# Altium schematic sheet TCAN1146_PWR_MGMT.SchDoc
size C; SheetNumber: 2; SheetTotal: 17
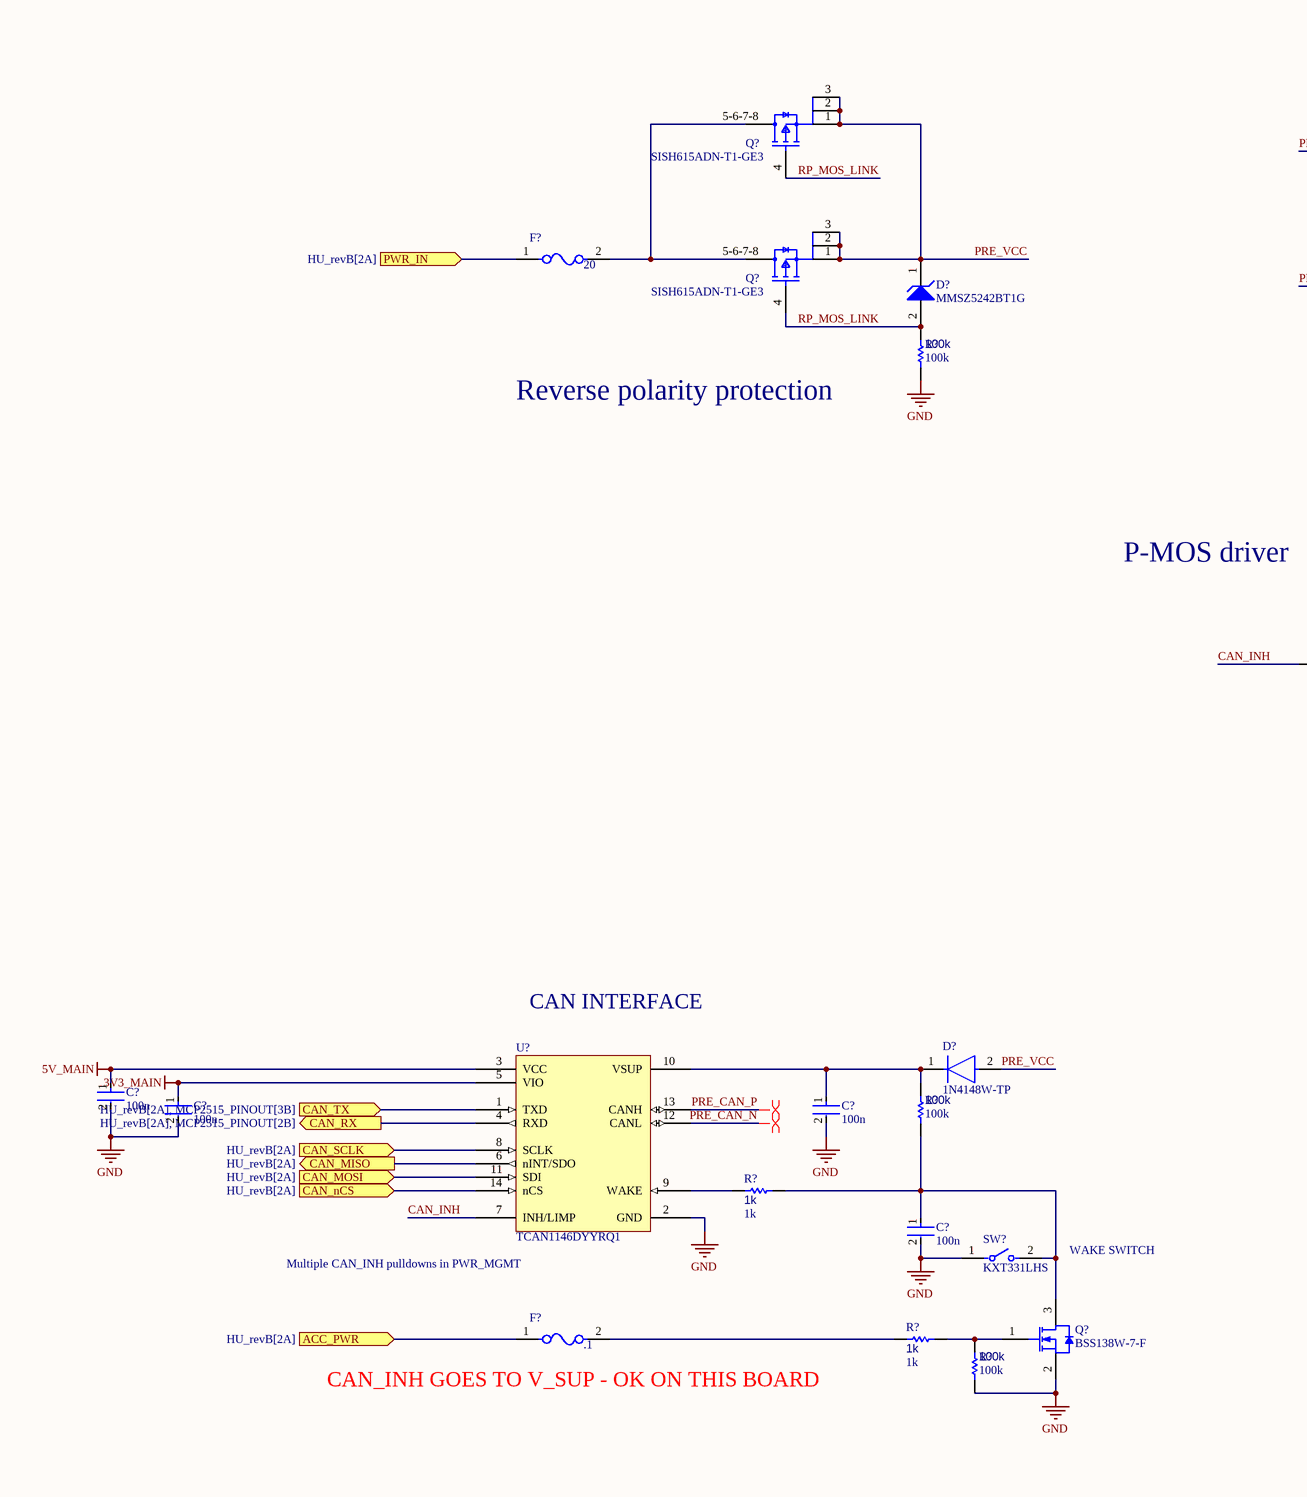
[diagram p0: TCAN1146_PWR_MGMT.SchDoc, left]
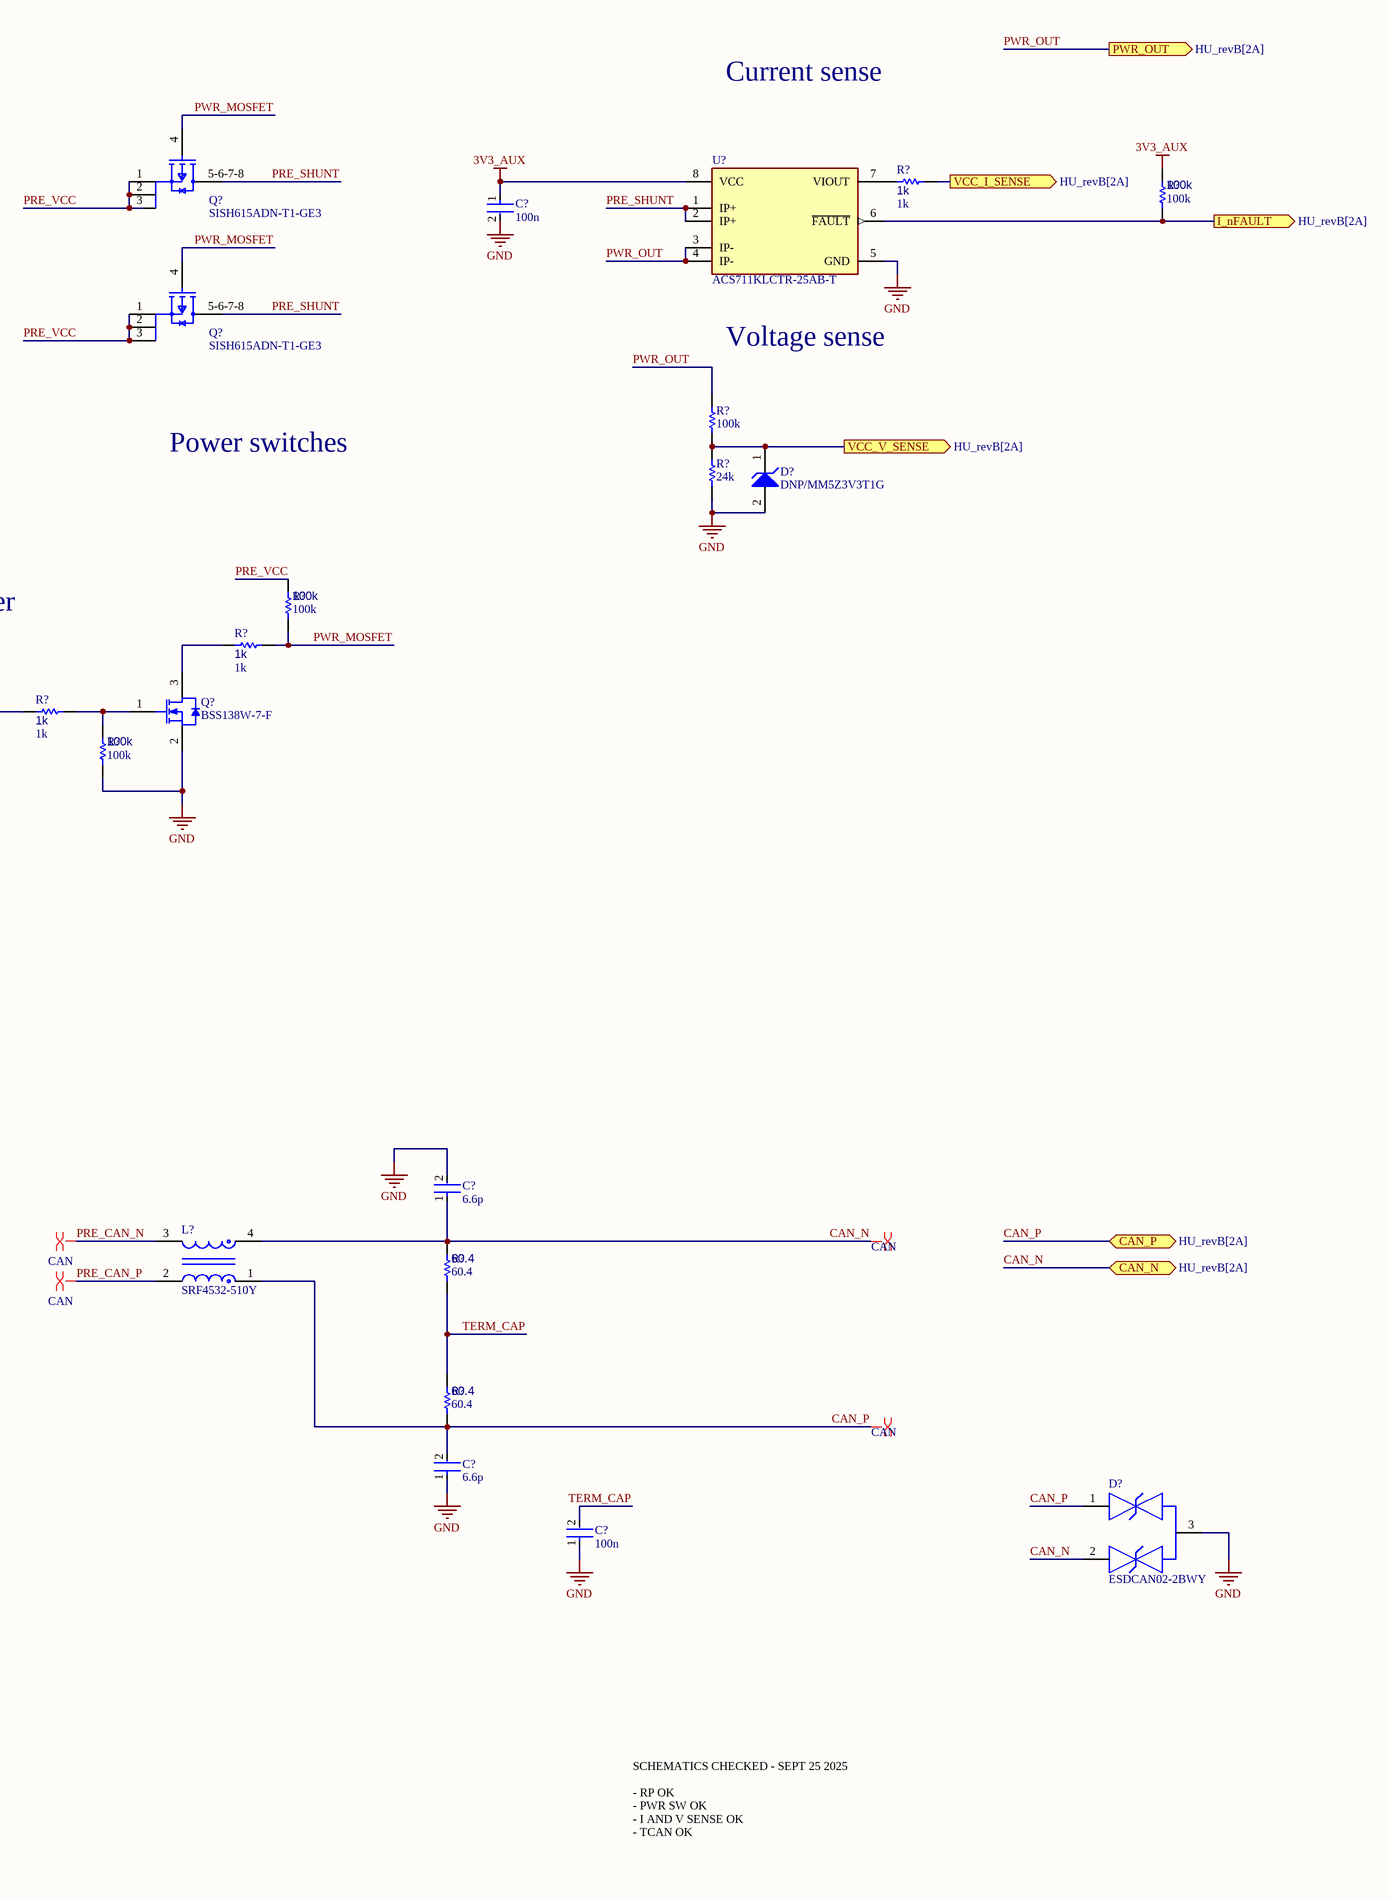
[diagram p1: TCAN1146_PWR_MGMT.SchDoc, right]

## Parts
(Parts that share a designator on the sheet are numbered #1, #2 ... from top to bottom, then left to right.)
C?#1  100n  [FP-0402-L_1_0_0_05-W_0_5-IPC_A]
C?#2  100n  [FP-0402-L_1_0_0_05-W_0_5-IPC_A]
C?#3  100n  [FP-0402-L_1_0_0_05-W_0_5-IPC_A]
C?#4  100n  [FP-0402-L_1_0_0_05-W_0_5-IPC_A]
C?#5  6.6p  [FP-0402-L_1_0_0_05-W_0_5-IPC_A]
C?#6  100n  [FP-0402-L_1_0_0_05-W_0_5-IPC_A]
C?#7  6.6p  [FP-0402-L_1_0_0_05-W_0_5-IPC_A]
C?#8  100n  [FP-0402-L_1_0_0_05-W_0_5-IPC_A]
D?#1  MMSZ5242BT1G  [ONSC-SOD-123-2-425-04_V]
D?#2  DNP/MM5Z3V3T1G  [ONSC-SOD-523-2-502-01_V]
D?#3  1N4148W-TP  [FP-SOD-123-IPC_A]
D?#4  ESDCAN02-2BWY  [FP-SOT323-3L-MFG]
F?#1  20  [FP-0685T-MFG]
F?#2  .1  [FP-0685T-MFG]
L?  SRF4532-510Y  [FP-SRF4532-MFG]
Q?#1  SISH615ADN-T1-GE3  [SISH615ADN-T1-GE3-Footprint-1]
Q?#2  SISH615ADN-T1-GE3  [SISH615ADN-T1-GE3-Footprint-1]
Q?#3  SISH615ADN-T1-GE3  [SISH615ADN-T1-GE3-Footprint-1]
Q?#4  SISH615ADN-T1-GE3  [SISH615ADN-T1-GE3-Footprint-1]
Q?#5  BSS138W-7-F  [DIOD-SOT323-3_V]
Q?#6  BSS138W-7-F  [DIOD-SOT323-3_V]
R?#1  1k  [R0603B]
R?#2  100k  [R0603B]
R?#3  100k  [R0603B]
R?#4  100k  [R0603B]
R?#5  24k  [R0603B]
R?#6  100k  [R0603B]
R?#7  1k  [R0603B]
R?#8  1k  [R0603B]
R?#9  100k  [R0603B]
R?#10  100k  [R0603B]
R?#11  1k  [R0603B]
R?#12  60.4  [R0603B]
R?#13  1k  [R0603B]
R?#14  100k  [R0603B]
R?#15  60.4  [R0603B]
SW?  KXT331LHS  [FP-KXT331LHS-MFG]
U?#1  ACS711KLCTR-25AB-T  [FP-LC-8-IPC_A]
U?#2  TCAN1146DYYRQ1  [TCAN1146DYYRQ1-Footprint-1]

## Ports
ACC_PWR (in, see HU_revB[2A]), CAN_MISO (out, see HU_revB[2A]), CAN_MOSI (in, see HU_revB[2A]), CAN_N (bidir, see HU_revB[2A]), CAN_nCS (in, see HU_revB[2A]), CAN_P (bidir, see HU_revB[2A]), CAN_RX (out, see HU_revB[2A], MCP2515_PINOUT[2B]), CAN_SCLK (in, see HU_revB[2A]), CAN_TX (in, see HU_revB[2A], MCP2515_PINOUT[3B]), I_nFAULT (out, see HU_revB[2A]), PWR_IN (in, see HU_revB[2A]), PWR_OUT (out, see HU_revB[2A]), VCC_I_SENSE (out, see HU_revB[2A]), VCC_V_SENSE (out, see HU_revB[2A])

## Nets
3V3_AUX: C?#1.1 R?#2.2 U?#1.8(VCC)
3V3_MAIN: C?#3.1 U?#2.5(VIO)
5V_MAIN: C?#2.1 U?#2.3(VCC)
GND: C?#1.2 C?#2.2 C?#3.2 C?#4.2 C?#5.2 C?#6.2 C?#7.1 C?#8.1 D?#2.2(A) D?#4.3 Q?#5.2(S) Q?#6.2(S) R?#3.1 R?#5.1 R?#9.1 R?#14.1 SW?.1 U?#1.5(GND) U?#2.2(GND)
ACC_PWR: F?#2.1 ; port ACC_PWR
CAN_INH: R?#8.1 U?#2.7(INH/LIMP)
CAN_MISO: U?#2.6(nINT/SDO) ; port CAN_MISO
CAN_MOSI: U?#2.11(SDI) ; port CAN_MOSI
CAN_N: C?#5.1 D?#4.2 L?.4 R?#12.2 ; port CAN_N
CAN_nCS: U?#2.14(nCS) ; port CAN_nCS
CAN_P: C?#7.2 D?#4.1 L?.1 R?#15.1 ; port CAN_P
CAN_RX: U?#2.4(RXD) ; port CAN_RX
CAN_SCLK: U?#2.8(SCLK) ; port CAN_SCLK
CAN_TX: U?#2.1(TXD) ; port CAN_TX
I_nFAULT: R?#2.1 U?#1.6(~{FAULT}) ; port I_nFAULT
PRE_CAN_N: L?.3 U?#2.12(CANL)
PRE_CAN_P: L?.2 U?#2.13(CANH)
PRE_SHUNT: Q?#1.5-6-7-8(D) Q?#3.5-6-7-8(D) U?#1.1(IP+) U?#1.2(IP+)
PRE_VCC: D?#1.1(K) D?#3.2(A) Q?#1.1(S) Q?#1.2(S) Q?#1.3(S) Q?#2.1(S) Q?#2.2(S) Q?#2.3(S) Q?#3.1(S) Q?#3.2(S) Q?#3.3(S) Q?#4.1(S) Q?#4.2(S) Q?#4.3(S) R?#6.2
PWR_IN: F?#1.1 ; port PWR_IN
PWR_MOSFET: Q?#1.4(G) Q?#3.4(G) R?#6.1 R?#7.2
PWR_OUT: R?#4.2 U?#1.3(IP-) U?#1.4(IP-) ; port PWR_OUT
RP_MOS_LINK: D?#1.2(A) Q?#2.4(G) Q?#4.4(G) R?#3.2
TERM_CAP: C?#8.2 R?#12.1 R?#15.2
VCC_I_SENSE: R?#1.1 ; port VCC_I_SENSE
VCC_V_SENSE: D?#2.1(K) R?#4.1 R?#5.2 ; port VCC_V_SENSE
NetC?#4_1: C?#4.1 D?#3.1(C) R?#10.2 U?#2.10(VSUP)
NetC?#6_1: C?#6.1 Q?#6.3(D) R?#10.1 R?#11.2 SW?.2
NetF?#1_2: F?#1.2 Q?#2.5-6-7-8(D) Q?#4.5-6-7-8(D)
NetF?#2_2: F?#2.2 R?#13.1
NetQ?#5_1: Q?#5.1(G) R?#8.2 R?#9.2
NetQ?#5_3: Q?#5.3(D) R?#7.1
NetQ?#6_1: Q?#6.1(G) R?#13.2 R?#14.2
NetR?#1_2: R?#1.2 U?#1.7(VIOUT)
NetR?#11_1: R?#11.1 U?#2.9(WAKE)

## Layout directives
differential pair: PRE_CAN_N, PRE_CAN_P
differential pair; differential pair class CAN: CAN_N, CAN_P, PRE_CAN_N, PRE_CAN_P

## Notes on the sheet
- Current sense
- Voltage sense
- (near R?#3) Reverse polarity protection
- Power switches
- P-MOS driver
- CAN INTERFACE
- (near U?#2) Multiple CAN_INH pulldowns in PWR_MGMT
- WAKE SWITCH
- (near F?#2) CAN_INH GOES TO V_SUP - OK ON THIS BOARD
- SCHEMATICS CHECKED - SEPT 25 2025
  - RP OK
  - PWR SW OK
  - I AND V SENSE OK
  - TCAN OK

## Library data of the parts
C?#1-C?#8 = CMP-001-00058-1: LARGE PADS, 0402 CAP, CHANGE COMMENT TO MATCH REAL P/N; Capacitor Type: Ceramic; Min Operating Temperature: -55°C; Mounting Technology: Surface Mount; Pins: 2; Case/Package: 0402; RoHS Compliant: Yes; Max Operating Temperature: 85°C
D?#1 = CMP-1060-00565-1: Zener Voltage Regulator, 500 mW, 2-Pin SOD-123, Pb-Free, Tape and Reel; Manufacturer: On Semiconductor; P Max (W): 0.5; VZ Typ (V): 12; PartNumber: MMSZ5242BT1G; PackageReference: SOD-123-2-425-04; ComponentLink3URL: http://www.onsemi.com/pub_link/Collateral/425-04.PDF; Mounting Technology: Surface Mount; ComponentLink2Description: Datasheet; ComponentLink1URL: http://www.onsemi.com/; ComponentLink3Description: Package Specification; PackageDescription: 2-Pin SOD, Body 1.6 x 2.69 mm; PackageVersion: Rev. G, 10/2009; ComponentLink1Description: Manufacturer URL; RoHS: Pb-Free; ComponentLink2URL: http://www.onsemi.com/pub_link/Collateral/MMSZ5221BT1-D.PDF; Packing: Tape and Reel; DatasheetVersion: Rev. 12
D?#2 = CMP-1060-00750-1: Zener Voltage Regulator, 500 mW, 2-Pin SOD-523, Pb-Free, Tape and Reel; Manufacturer: On Semiconductor; P Max (W): 0.5; VZ Typ (V): 3.3; RoHS: Pb-Free; ComponentLink2Description: Datasheet; PackageReference: SOD-523-2-502-01; DatasheetVersion: Rev. 10; ComponentLink1Description: Manufacturer URL; PackageVersion: Rev. E, 09/2010; ComponentLink3URL: http://www.onsemi.com/pub_link/Collateral/502-01.PDF; ComponentLink2URL: http://www.onsemi.cn/pub_link/Collateral/MM5Z2V4T1-D.PDF; Mounting Technology: Surface Mount; PartNumber: MM5Z3V3T1G; Packing: Tape and Reel; PackageDescription: 2-Pin SOD, Body 1.2 x 0.8 mm; ComponentLink1URL: http://www.onsemi.com/; ComponentLink3Description: Package Specification
D?#3 = CMP-2000-04993-2: DIODE GEN PURP 100V 150MA SOD123; Max Reverse Leakage Current: 5uA; Max Surge Current: 2A; Reverse Recovery Time: 4ns; Polarity: Standard; Capacitance: 4pF; Max Forward Surge Current (Ifsm): 1A; Element Configuration: Single; Power Dissipation: 400mW; Forward Voltage: 1V; Radiation Hardening: No; Lead Free: Lead Free; Max Reverse Voltage (DC): 100V; Current Rating: 150mA; Forward Current: 150mA; Packaging: Tape and Reel; Number of Pins: 2; Package Quantity: 3000; Max Operating Temperature: 150°C; Min Operating Temperature: -65°C; Average Rectified Current: 150mA; Recovery Time: 4ns; Output Current: 150mA; Peak Non-Repetitive Surge Current: 2A; Width: 1.8mm; Voltage Rating (DC): 100V; Height: 1.2mm; Max Repetitive Reverse Voltage (Vrrm): 100V; Mount: Surface Mount; Length: 2.85mm
D?#4 = CMP-12225-000055-1: TVS DIODE 26.5V 44V SOT323-3; Manufacturer: STMicroelectronics; Value: 3pF; Direction: Bidirectional; Breakdown Voltage: 28.5V; Automotive Grade: Grade 0; Standoff Height: 0mm; Peak Pulse Power: 170W; Peak Pulse Current: 3A; Number Of Channels: 2; Max Junction Temp: +175°C; Mouser Description: TVS Diodes / ESD Suppressors Automotive dual-line Transil, Transient voltage suppressor (TVS) for CAN bus; Height: 1.1mm; Category: Diode; Reverse Standoff Voltage: 26.5V; Device Class L1: Circuit Protection; Temperature: -55°C to +175°C; RoHS: TRUE; ComponentLink2URL: https://www.st.com/resource/en/datasheet/esdcan02-2bwy.pdf; Device Class L3: unset; Device Class L2: TVS Diodes; Temperature Range High: +175°C; Octopart: https://octopart.com/esdcan02-2bwy-stmicroelectronics-58631133; Ipc Land Pattern Name: SOT65P210X95-3; Temperature Range Low: -55°C; Capacitance: 3pF; Digikey Description: TVS DIODE 26.5V 44V SOT323-3; Automotive: Yes; ComponentLink2Description: Datasheet; Clamping Voltage: 44V; Manufacturer Part Number: ESDCAN02-2BWY; Lead Free: Yes; Package: SOT323-3L
F?#1 F?#2 = CMP-16042-000006-1: FUSE BOARD MNT 5A 63VAC/VDC 1206; RoHS Compliant: Yes
L? = CMP-07251-000006-1: CMC 51UH 200MA 2LN 2KOHM SMD; Element Configuration: Dual; Number of Lines: 2; Core Material: Ferrite; Impedance: 2kR; Test Frequency: 100kHz; Voltage Rating (DC): 50V; Insulation Resistance: 10MR; Material: Steel; Tolerance: 50%; DC Resistance (DCR): 3.5R; RoHS Compliant: Yes; Mount: Surface Mount; REACH SVHC: No SVHC; Termination: SMD/SMT; DC Current: 200mA; Current: 200mA; Lead Free: Lead Free; Contact Plating: Tin; Length: 4.5mm; Max DC Current: 200mA; Width: 0.126inch; Case/Package: 4532; Packaging: Tape and Reel; Package Quantity: 1; Min Operating Temperature: -40°C; Depth: 3.4mm; Series: SRF4532; Max Operating Temperature: 125°C; Current Rating: 200mA; Self Resonant Frequency: 100kHz; Height: 0.118inch; Inductance: 51uH; Resistance: 2kR
Q?#1-Q?#4 = CMP-013-00018-2: Trans MOSFET P-CH 20V 22.1A 8-Pin PowerPAK 1212 EP T/R; Source: SISH615ADN-T1-GE3.SchLib; Design Item ID: CMP-013-00036-4; Component Type: Standard; Pins: 5
Q?#5 Q?#6 = CMP-2000-05968-1: N-Channel Enhancement Mode Mosfet, 50 V, 200 mA, -55 to 150 degC, 6-Pin SOT-323, RoHS, Tape and Reel; Typical Turn-Off Delay Time: 20ns; Number of Channels: 1Channel; Type: EnhancementModeFieldEffectTransistor; Brand: DiodesIncorporated; Vds - Drain-Source Breakdown Voltage: 75V; Vgs - Gate-Source Voltage: 20V; Rds On - Drain-Source Resistance: 1.4Ohms; Transistor Type: 1N-Channel; Configuration: Single; Unit Weight: 0.000212oz; Pd - Power Dissipation: 200mW; Id - Continuous Drain Current: 200mA; Forward Transconductance - Min: 0.1S; Manufacturer URL: http://www.diodes.com/; Series: BSS138; Package Description: 3-Pin Small Outline Transistor, Body 2 x 1.25 mm, Pitch 0.65 mm; Mounting Technology: SurfaceMount; Product Category: MOSFET; RoHS: True; Maximum Operating Temperature: +150C; Height: 1mm; Length: 2.2mm; Technology: Si; Width: 1.35mm; Datasheet URL: http://www.diodes.com/_files/datasheets/ds30206.pdf; Manufacturer: DiodesIncorporated; Package / Case: SOT-323-3; Typical Turn-On Delay Time: 20ns; Transistor Polarity: N-Channel; Factory Pack Quantity: 3000; Packaging: Reel; Product: MOSFETSmallSignal; Datasheet Version: Rev. 11-2, 09/2013; Package Reference: SOT323; Minimum Operating Temperature: -55C; Mounting Style: SMD/SMT; Channel Mode: Enhancement
R?#1-R?#15 = CMP-009-00002-14: Resistor
  R?#1 R?#7 R?#8 R?#11 R?#13: Value: 1k
  R?#2-R?#4 R?#6 R?#9 R?#10 R?#14: Value: 100k
  R?#5: Value: 24k
  R?#12 R?#15: Value: 60.4
SW? = CMP-10040-000029-1: SWITCH TACTILE SPST-NO 0.02A 15V; Operating Force: 240gf; Switch Travel: 0.13mm; Illumination Type: Non-Illuminated; Throw Configuration: SPST; Number of Ports: 1; Current Rating: 5A; Mechanical Life: 500000Cycles; Switch Function: Off-Mom; Connector Type: USB; Actuator Type: Standard; Gender: Receptacle; Number of Contacts: 24; Contact Plating: Gold; Insulation Color: Black; Min Operating Temperature: -40°C; Packaging: Tape and Reel; Flammability Rating: UL94 V-0; Max Operating Temperature: 85°C; Termination: Solder; Mount: Surface Mount
U?#1 = CMP-1557-00015-2: SENSOR CURRENT HALL 25A AC/DC; Bandwidth: 100kHz; Min Supply Voltage: 3V; Polarity: Bidirectional; Max Supply Voltage: 5.5V; Max Supply Current: 5.5mA; Number of Channels: 1; Quiescent Current: 4mA; Sensitivity: 55mV/A; Accuracy: 4%; Linearity: 1%; Operating Supply Voltage: 3.3V; Response Time: 4.6us; Case/Package: SOIC; Min Operating Temperature: -40°C; RoHS Compliant: Yes; Length: 4.9mm; Package Quantity: 1; Number of Pins: 8; Width: 3.9mm; REACH SVHC: No SVHC; -3db Bandwidth: 100kHz; Series: -; Packaging: Tape and Reel; Max Operating Temperature: 125°C; Current Sensing: 25A; Height: 1.5mm; Frequency: 100kHz
U?#2 = CMP-318-000000-2: Automotive CAN FD transceiver with watchdog, bus diagnostics and partial networking via sele 14-SOT-23-THIN -40 to 150; Component Type: Standard; Design Item ID: CMP-015-00012-2; Pin Count: 14; Source: TCAN1146DYYRQ1.SchLib